# Altium schematic sheet 02_USB_MCU.SchDoc: USB & Microcontroller
size A4; Date: 08/06/2019; Author: Luis Sánchez Velasco; DocumentNumber: 2; Revision: 0; SheetNumber: 2; SheetTotal: 4
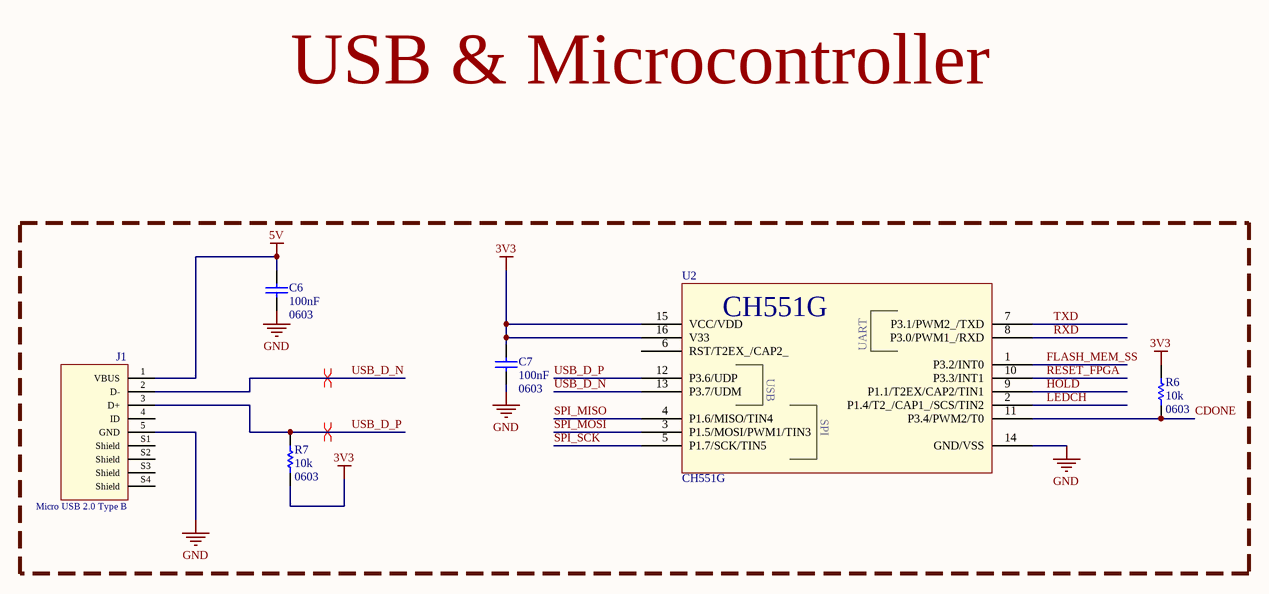
[diagram p0: 02_USB_MCU.SchDoc]

## Parts
C6  value 100nF  Package: 0603  [0603 CAP]  (hidden comment: Ceramic capacitor)
C7  value 100nF  Package: 0603  [0603 CAP]  (hidden comment: Ceramic capacitor)
J1  Micro USB 2.0 Type B  [629105136821]
R6  value 10k  Package: 0603  [Resistencia 0603]  (hidden comment: Resistor)
R7  value 10k  Package: 0603  [Resistencia 0603]  (hidden comment: Resistor)
U2  CH551G  [CH551]

## Nets
3V3: C7.1 R6.2 R7.2 U2.15(VCC/VDD) U2.16(V33)
5V: C6.1 J1.1(VBUS)
GND: C6.2 C7.2 J1.5(GND) U2.14(GND/VSS)
CDONE: R6.1 U2.11(P3.4/PWM2/T0)
FLASH_MEM_SS: U2.1(P3.2/INT0)
HOLD: U2.9(P1.1/T2EX/CAP2/TIN1)
LEDCH: U2.2(P1.4/T2_/CAP1_/SCS/TIN2)
RESET_FPGA: U2.10(P3.3/INT1)
RXD: U2.8(P3.0/PWM1_/RXD)
SPI_MISO: U2.4(P1.6/MISO/TIN4)
SPI_MOSI: U2.3(P1.5/MOSI/PWM1/TIN3)
SPI_SCK: U2.5(P1.7/SCK/TIN5)
TXD: U2.7(P3.1/PWM2_/TXD)
USB_D_N: J1.2(D-) U2.13(P3.7/UDM)
USB_D_P: J1.3(D+) R7.1 U2.12(P3.6/UDP)

Not connected (* = marked no-connect by the designer): J1 4(ID) S1(Shield) S2(Shield) S3(Shield) S4(Shield); U2 6(RST/T2EX_/CAP2_)

## Layout directives
differential pair: USB_D_N, USB_D_P

## Notes on the sheet
- USB & Microcontroller
- Sheet title:
- NodeFPGA
- Project title:
- Desginer:
- Date:
- Revision:
- Sheet
- of
- (in symbol CH551G) UART; USB; SPI

## Library data of the parts
C6 C7 = Capacitor: vendor: LCSC; vendorID: 0603F104M500NT; Supplier 1: Mouser; Supplier Part Number 1: 80-C1206C104K5R; ManufacturerReference: -; price: 0.0023
J1 = 629105136821: Micro USB 2.0 Type B Horizontal SMT 5 Contacts WR-COM; Rated Current: 1 A; Gender: Female; vendor: LCSC; vendorID: C21377; ComponentLink1Description: Manufacturer; ComponentLink1URL: http://www.we-online.de; ComponentLink2Description: Datasheet; ComponentLink2URL: http://katalog.we-online.de/em/datasheet/629105136821.pdf; Part Number: 629105136821; Published Date: May 2018; Publisher: Wurth Elektronik; Orientation: Horizontal; Interface Type: Micro USB 2.0 Type B; Operating Temperature: -40 to 85 degC; Mounting Technology: SMT; Packaging: Tape and Reel; price: 0.05; Parameter 1: *
R6 R7 = Resistor: vendor: LCSC; vendorID: 0603WAF1002T5E; Supplier 1: Farnell; Supplier Part Number 1: 2358436; ManufacturerReference: -; price: 0.0009
  R6: Parameter 1: *
U2 = CH551G: Microcontroller wUSB support; vendor: LCSC; vendorID: C108958; ComponentLink1Description: LCSC; ComponentLink1URL: https://lcsc.com/product-detail/USB_CH551G_C108958.html; package: SOP-16; price: 0.3; ManufacturerRefenrece: CH551G